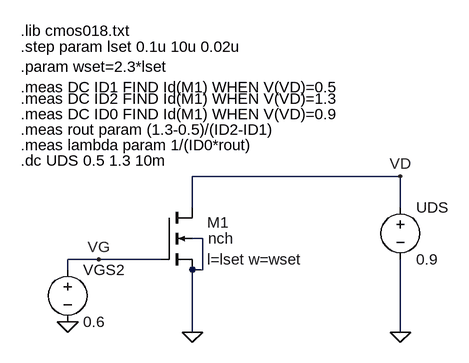
[diagram p0: schematic Draft4N.asc]
Draft4N.asc, the LTspice schematic file:
Version 4
SHEET 1 1356 680
WIRE 544 176 224 176
WIRE 224 224 224 176
WIRE 544 224 544 176
WIRE 240 272 224 272
WIRE 80 304 32 304
WIRE 176 304 80 304
WIRE 32 320 32 304
WIRE 240 320 240 272
WIRE 240 320 224 320
WIRE 224 416 224 320
WIRE 544 416 544 304
FLAG 224 416 0
FLAG 544 416 0
FLAG 80 304 VG
FLAG 32 400 0
FLAG 544 176 VD
SYMBOL voltage 32 304 R0
WINDOW 123 0 0 Left 0
WINDOW 39 0 0 Left 0
SYMATTR InstName VGS2
SYMATTR Value 0.6
SYMBOL voltage 544 208 R0
WINDOW 123 0 0 Left 0
WINDOW 39 0 0 Left 0
SYMATTR InstName UDS
SYMATTR Value 0.9
SYMBOL nmos4 176 224 R0
WINDOW 0 71 23 Left 2
WINDOW 3 72 48 Left 2
WINDOW 123 71 80 Left 2
SYMATTR InstName M1
SYMATTR Value nch
SYMATTR Value2 l=lset w=wset
TEXT -40 -48 Left 2 !.lib cmos018.txt
TEXT -40 152 Left 2 !.dc UDS 0.5 1.3 10m
TEXT -40 -24 Left 2 !.step param lset 0.1u 10u 0.02u\n.param wset=2.3*lset\n.meas DC ID1 FIND Id(M1) WHEN V(VD)=0.5
TEXT -40 56 Left 2 !.meas DC ID2 FIND Id(M1) WHEN V(VD)=1.3
TEXT -40 80 Left 2 !.meas DC ID0 FIND Id(M1) WHEN V(VD)=0.9
TEXT -40 104 Left 2 !.meas rout param (1.3-0.5)/(ID2-ID1)
TEXT -40 128 Left 2 !.meas lambda param 1/(ID0*rout)

The netlist it stands for:
* Draft4N.asc
VGS2 VG 0 0.6
V§UDS VD 0 0.9
M1 VD VG 0 0 nch l=lset w=wset
.model NMOS NMOS
.model PMOS PMOS
.lib standard.mos
.lib cmos018.txt
.dc UDS 0.5 1.3 10m
.step param lset 0.1u 10u 0.02u
.param wset=2.3*lset
.meas DC ID1 FIND Id(M1) WHEN V(VD)=0.5
.meas DC ID2 FIND Id(M1) WHEN V(VD)=1.3
.meas DC ID0 FIND Id(M1) WHEN V(VD)=0.9
.meas rout param (1.3-0.5)/(ID2-ID1)
.meas lambda param 1/(ID0*rout)
.backanno
.end